# Altium schematic sheet STM32_FYP_ADC_Module.SchDoc
size A4; Organization: Altium Limited; Address1: L3, 12a Rodborough Rd; Address2: Frenchs Forest; Address3: NSW; Address4: Australia 2086
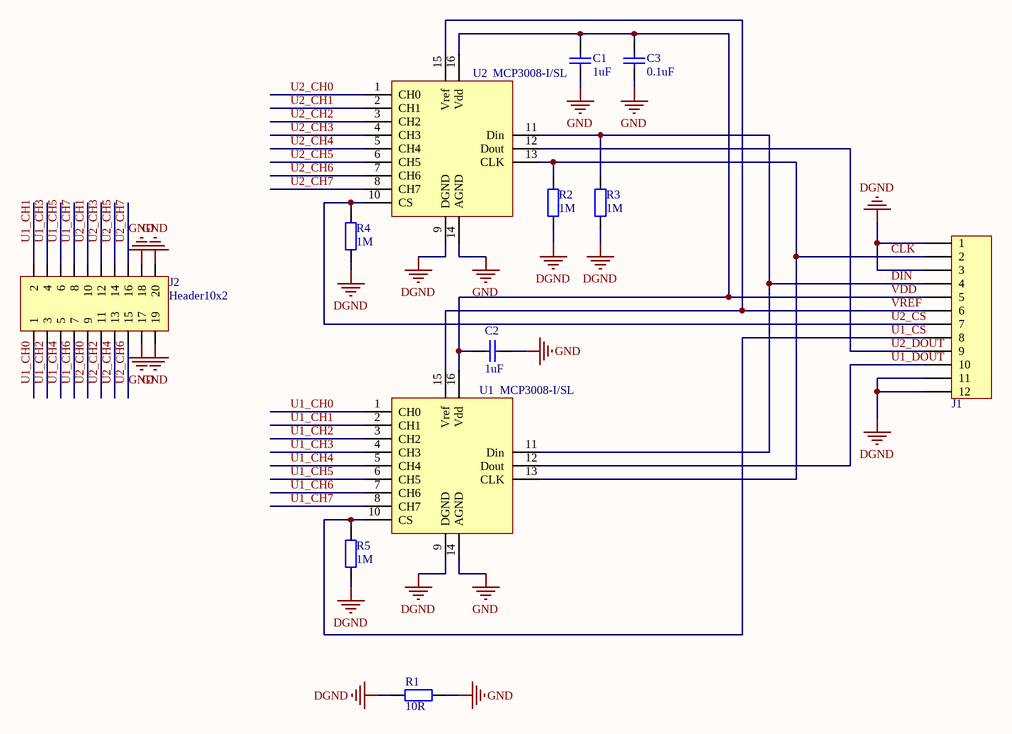
[diagram p0: STM32_FYP_ADC_Module.SchDoc]

## Parts
C1  1uF  [0805C_M]
C2  1uF  [0805C_M]
C3  0.1uF  [0805C_M]
J1  Header12  [12P-2.54-H]  (value not drawn)
J2  Header10x2  [10PX2-2.54 - H]
R1  10R  [0805R_M]
R2  1M  [0805R_M]
R3  1M  [0805R_M]
R4  1M  [0805R_M]
R5  1M  [0805R_M]
U1  MCP3008-I/SL  [SOIC-16_150mil]
U2  MCP3008-I/SL  [SOIC-16_150mil]

## Nets
DGND: J1.1 J1.3 J1.11 J1.12 R1.1 R2.2 R3.2 R4.2 R5.2 U1.9(DGND) U2.9(DGND)
GND: C1.1 C2.1 C3.2 J2.17 J2.18 J2.19 J2.20 R1.2 U1.14(AGND) U2.14(AGND)
CLK: J1.2 R2.1 U1.13(CLK) U2.13(CLK)
DIN: J1.4 R3.1 U1.11(Din) U2.11(Din)
U1_CH0: J2.1 U1.1(CH0)
U1_CH1: J2.2 U1.2(CH1)
U1_CH2: J2.3 U1.3(CH2)
U1_CH3: J2.4 U1.4(CH3)
U1_CH4: J2.5 U1.5(CH4)
U1_CH5: J2.6 U1.6(CH5)
U1_CH6: J2.7 U1.7(CH6)
U1_CH7: J2.8 U1.8(CH7)
U1_CS: J1.8 R5.1 U1.10(CS)
U1_DOUT: J1.10 U1.12(Dout)
U2_CH0: J2.9 U2.1(CH0)
U2_CH1: J2.10 U2.2(CH1)
U2_CH2: J2.11 U2.3(CH2)
U2_CH3: J2.12 U2.4(CH3)
U2_CH4: J2.13 U2.5(CH4)
U2_CH5: J2.14 U2.6(CH5)
U2_CH6: J2.15 U2.7(CH6)
U2_CH7: J2.16 U2.8(CH7)
U2_CS: J1.7 R4.1 U2.10(CS)
U2_DOUT: J1.9 U2.12(Dout)
VDD: C1.2 C2.2 C3.1 J1.5 U1.16(Vdd) U2.16(Vdd)
VREF: J1.6 U1.15(Vref) U2.15(Vref)

## Notes on the sheet
- Title
- Size:
- Date:
- A4
- Number:
- Time:
- Revision:
- Sheet
- of
- File:

## Library data of the parts
C1 C2 = Cap: 无极性电容; Value: 0.1uF; Published: 8-Jun-2000; LatestRevisionDate: 17-Jul-2002; LatestRevisionNote: Re-released for DXP Platform.; PackageReference: RAD-0.3; Publisher: Altium Limited; PackageDescription: Radial Cap, Thru-Hole; 2 Leads; 0.3 in Pin Spacing
C3 = Cap: 无极性电容; Published: 8-Jun-2000; LatestRevisionDate: 17-Jul-2002; LatestRevisionNote: Re-released for DXP Platform.; PackageReference: RAD-0.3; Publisher: Altium Limited; PackageDescription: Radial Cap, Thru-Hole; 2 Leads; 0.3 in Pin Spacing; Value: 0.1uF
J1 = Header12: 12PIN插座
R1-R5 = Res: 电阻; Published: 8-Jun-2000; LatestRevisionDate: 17-Jul-2002; LatestRevisionNote: Re-released for DXP Platform.; PackageReference: AXIAL-0.4; Publisher: Altium Limited; PackageDescription: Axial Device, Thru-Hole; 2 Leads; 0.4 in Pin Spacing
U1 U2 = MCP3008: ADC模数转换芯片